# Altium schematic sheet SPI Extender 2.SchDoc
size 297 x 209 mm; SheetNumber: 4; SheetTotal: 5; swcgroup: Innovation and Research; Org: Sainsbury Wellcome Centre; Add1: 25 Howland Street; Add2: London; Add3: W1T 4JG; WebAddress: www.sainsburywellcome.org; SheetSize: A4; SheetName: SPI Extender 2
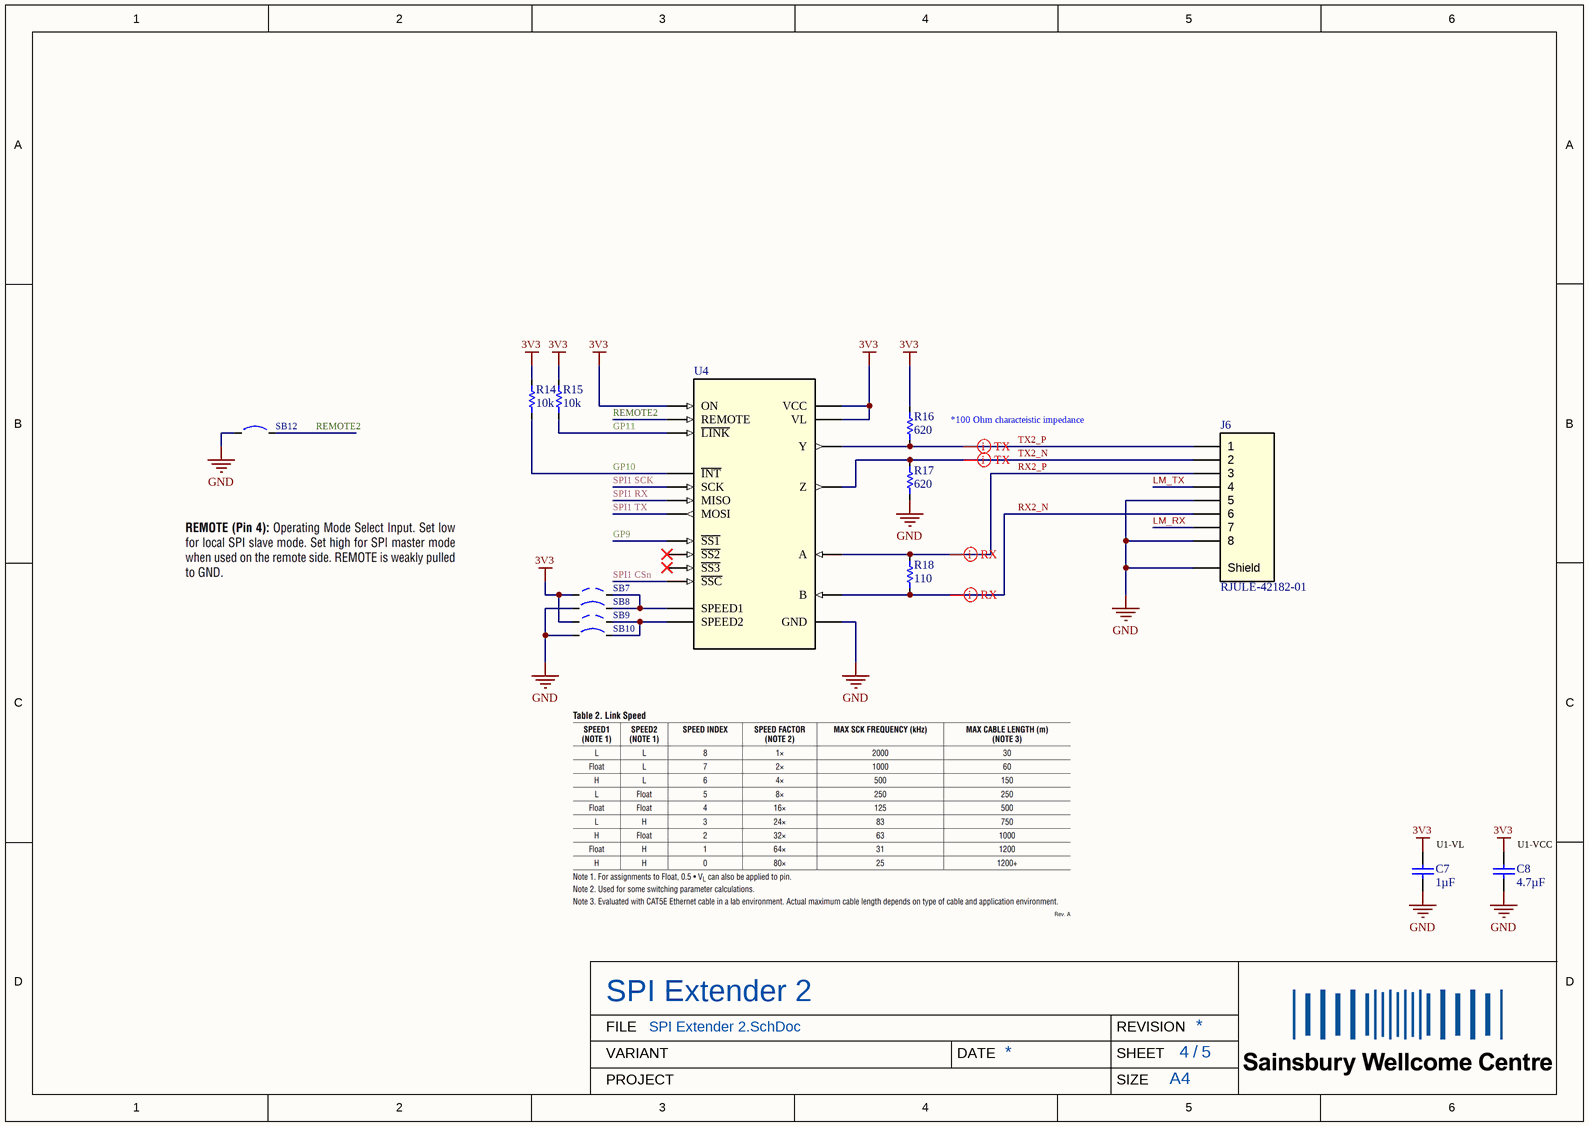
[diagram p0: SPI Extender 2.SchDoc]

## Parts
C7  value 1µF  [FP-GRM188-0_1-e0_2_0_5-IPC_B]  (hidden comment: C0603-1uF-25V-10%-X7R)
C8  value 4.7µF  [CAPC2012X88N]  (hidden comment: C0805-4.7uF-16V-5%-X7R)
J6  RJULE4218201  [RJULE-42182-01 - RM]  (value not drawn)
R14  value 10k  [FP-CPF0603-IPC_B]  (hidden comment: R0603-10k-1/16W-0.1%)
R15  value 10k  [FP-CPF0603-IPC_B]  (hidden comment: R0603-10k-1/16W-0.1%)
R16  value 620  [FP-CPF0603-IPC_B]  (hidden comment: R0603-620R-1/16W-0.1%)
R17  value 620  [FP-CPF0603-IPC_B]  (hidden comment: R0603-620R-1/16W-0.1%)
R18  value 110  [FP-CPF0603-IPC_B]  (hidden comment: R0603-110R-1/16W-0.1%)
SB7  Solder Bridge 0603 Off  [Solder Bridge 0603 Off]  (value not drawn)  (no BOM)
SB8  Solder Bridge 0603 On  [Solder Bridge 0603 On]  (value not drawn)
SB9  Solder Bridge 0603 Off  [Solder Bridge 0603 Off]  (value not drawn)  (no BOM)
SB10  Solder Bridge 0603 On  [Solder Bridge 0603 On]  (value not drawn)
SB12  Solder Bridge 0603 On  [Solder Bridge 0603 On]  (value not drawn)
U4  LTC4332HUFD#PBF  [FP-UFD-20-05-08-1711-IPC_B]  (value not drawn)

## Nets
3V3: C7.2 C8.2 R14.2 R15.2 R16.2 SB7.1 SB9.1 U4.1(VCC) U4.2(VL) U4.3(ON)
GND: C7.1 C8.1 J6.5 J6.8 J6.MH(Shield) R17.1 SB8.1 SB10.1 SB12.1 U4.16(GND)
GP9: U4.11(~{SS1})
GP10: R14.1 U4.10(~{INT})
GP11: R15.1 U4.5(~{LINK})
LM_RX: J6.7
LM_TX: J6.4
REMOTE2: SB12.2 U4.4(REMOTE)
RX2_N: J6.6 R18.1 U4.19(B)
RX2_P: J6.3 R18.2 U4.20(A)
SPI1 CSn: U4.6(~{SSC})
SPI1 RX: U4.9(MISO)
SPI1 SCK: U4.7(SCK)
SPI1 TX: U4.8(MOSI)
TX2_N: J6.2 R17.2 U4.18(Z)
TX2_P: J6.1 R16.1 U4.17(Y)
NetSB7_2: SB7.2 SB8.2 U4.14(SPEED1)
NetSB9_2: SB9.2 SB10.2 U4.15(SPEED2)

Not connected (* = marked no-connect by the designer): U4 12(~{SS2})* 13(~{SS3})*

## Layout directives
differential pair: RX2_N, RX2_P, TX2_N, TX2_P

## Notes on the sheet
- (near R16) *100 Ohm characteistic impedance
- (near C7) U1-VL
- (near C8) U1-VCC
- FILE
- VARIANT
- DATE
- REVISION
- SHEET
- /
- PROJECT
- SIZE

## Library data of the parts
C7 = CMP-611-0033-2: 1µF ±10% 25V Ceramic Capacitor X7R 0603 (1608 Metric); Capacitance: 1uF; Pick&PlaceFootprint: 0603_CAP; Depth: 0.8mm; Width: 0.8mm; Dielectric: X7R; Thickness: 0.035inch; Capacitor Type: Ceramic; Package Quantity: 1; Max Operating Temperature: 125°C; Mount: Surface Mount; Termination: Wraparound; Case/Package: 0603; Lead Free: Lead Free; RoHS Compliant: Yes; Case Code (Imperial): 0603; Min Operating Temperature: -55°C; Size: 0.8mm; REACH SVHC: Yes; Height: 0.9mm; Packaging: Tape and Reel; Voltage Rating (DC): 25V; Series: GRM; Length: 1.6mm; Material: Ceramic; Case Code (Metric): 1608; Weight: 0.000222oz; Voltage: 25V; Tolerance: 10%; RoHS: Yes; Construction: Flat; Voltage Rating: 25V; Radiation Hardening: No
C8 = CMP-611-0019-6: 4.7uF ±5% 16V Ceramic Capacitor X7R 0805 (2012 Metric); Dissipation Factor: 0.025%; Pick&PlaceFootprint: C0805; RoHS: Yes; Min Operating Temperature: -55°C; Thickness: 0.053inch; Voltage Rating: 16V; Dielectric: X7R; Mount: Surface Mount; Case/Package: 0805; Capacitor Type: Ceramic; Depth: 1.25mm; Tolerance: 5%; Package Quantity: 1; Case Code (Metric): 2012; Material: Ceramic; REACH SVHC: No SVHC; Packaging: Cut Tape; Lead Free: Lead Free; Number of Pins: 2; Case Code (Imperial): 0805; Radiation Hardening: No; Max Operating Temperature: 125°C; Capacitance: 4.7uF; Length: 2mm; Voltage: 16V; Height: 1.25mm; Voltage Rating (DC): 16V; Termination: SMD/SMT; Width: 0.049inch
J6 = CMP-300-0001-5: Modular Jack - Right Angle, Input Output Connectors RJ45, 8P8C, Without LEDs, Shield.; pin to pad: MH>MH1+MH2; PartNumber: RJULE-42182-01; Mount: Surface Mount
R14 R15 = CMP-633-0002-15: Surface Mount Resistor 10k Ohm 1/16 W 0.1% 0603 (1608 Metric); Max Power Dissipation: 62.5 mW; Temperature Coefficient: 25ppm/°C; Voltage Rating: 50V; Number of Resistors: 1; Pick&PlaceFootprint: R0603; Power Rating: 62.5mW; Case Code (Metric): 1608; Tolerance: 0.1%; Resistor Type: Thin Film; Case/Package: 0603; Number of Terminations: 2; Packaging: Tape and Reel; Height: 0.45mm; Termination: Solder; Size Code: 0603; Resistance: 10k; Case Code (Imperial): 0603; Technology: Thin Film; Min Operating Temperature: -55°C; RoHS: Yes; ELV: Compliant; Resistance Tolerance: 0.1%; Weight: 7.1E-05oz; Series: CPF; Composition: Thin Film; Voltage Rating (DC): 50V; Length: 1.6mm; REACH SVHC: No SVHC; Mount: Surface Mount; RoHS Compliant: Yes; Number of Pins: 2; Width: 0.8mm; Max Operating Temperature: 155°C
R16 R17 = CMP-633-0079-2: Surface Mount Resistor 620 Ohm 1/16 W 0.1% 0603 (1608 Metric); Number of Resistors: 1; Voltage Rating: 50V; Max Power Dissipation: 62.5 mW; Pick&PlaceFootprint: R0603; Power Rating: 62.5mW; Temperature Coefficient: 25ppm/°C; RoHS Compliant: Yes; Mount: Surface Mount; Min Operating Temperature: -55°C; Construction: Chip; Technology: THIN FILM; Weight: 7.1E-05oz; Composition: Thin Film; Width: 0.8mm; Length: 1.6mm; Height: 0.45mm; Resistor Type: FIXED RESISTOR; Size Code: 0603; Voltage Rating (DC): 50V; ELV: Compliant; Case Code (Imperial): 0603; Series: CPF; Case/Package: 0603; Termination: Wraparound; REACH SVHC: Yes; Case Code (Metric): 1608; Resistance Tolerance: 0.1%; Number of Terminations: 2; Tolerance: 0.1%; Packaging: Tape and Reel; Resistance: 620; RoHS: Yes; Number of Pins: 2; Max Operating Temperature: 155°C
R18 = CMP-633-0080-2: Surface Mount Resistor 110 Ohm 1/16 W 0.1% 0603 (1608 Metric); Temperature Coefficient: 25ppm/°C; Max Power Dissipation: 62.5 mW; Voltage Rating (DC): 50V; Pick&PlaceFootprint: R0603; Power Rating: 62.5mW; Number of Resistors: 1; ELV: Compliant; Resistance Tolerance: 0.1%; Case/Package: 0603; Number of Pins: 2; Length: 1.6mm; Series: CPF; Max Operating Temperature: 155°C; Weight: 7.1E-05oz; Packaging: Tape and Reel; RoHS Compliant: Yes; Case Code (Metric): 1608; RoHS: Yes; Mount: Surface Mount; Voltage Rating: 50V; Termination: Wraparound; Resistance: 110; Size Code: 0603; Width: 0.8mm; Tolerance: 0.1%; Case Code (Imperial): 0603; Height: 0.45mm; Composition: Thin Film; REACH SVHC: Yes; Min Operating Temperature: -55°C; Technology: THIN FILM; Number of Terminations: 2; Construction: Chip; Resistor Type: FIXED RESISTOR
SB7 SB9 = CMP-B00-0001-2
SB8 SB10 SB12 = CMP-B00-0000-4: PartNumber: R0603-0R-1/16W-0.1%; Pick&PlaceFootprint: R0603; Pins: 2; Mount: SMD; Case/Package: R0603
U4 = CMP-930-0001-1: SPI Extender Over Rugged Differential Link; pin to pad: 16>16+21; Pick&PlaceFootprint: QFN-20-4-5; PartNumber: LTC4332HUFD#PBF; RoHS Compliant: Yes